# Altium project sensor_circuit.PrjPcb
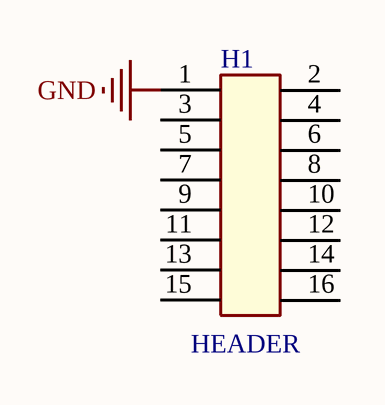
[diagram p0: sensor_circuit.SchDoc]
1 sheet, 1 parts. Net scope: global (net labels, ports and power ports of the same name join across sheets).
Board files: sensor_flex.PcbDoc, sensor_bottom_1127.PcbDoc, sensor_top_1127.PcbDoc

## Sheet sensor_circuit.SchDoc
size B

### Parts
H1  HEADER  [HD_male_8x2_100mil_straight]

### Nets
GND: H1.1

Not connected (* = marked no-connect by the designer): H1 2 3 4 5 6 7 8 9 10 11 12 13 14 15 16

### Library data of the parts
H1 = HD_8x2: Header, 8-pins/row, double row,